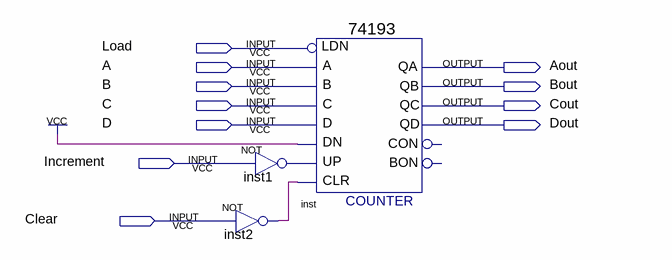
[diagram p0: schematic sheet]
// Quartus schematic 4BitCounter.bdf as structural Verilog: 3 symbols, 11 pins
module \4BitCounter  (
  input  Load,
  input  A,
  input  B,
  input  C,
  input  D,
  input  Increment,
  input  Clear,
  output Aout,
  output Bout,
  output Cout,
  output Dout
);

  wire inst1_out, inst2_out;

  not inst1 (inst1_out, Increment);
  not inst2 (inst2_out, Clear);
  \74193  inst (
    .D(D), .C(C), .B(B), .A(A), .CLR(inst2_out), .UP(inst1_out), .DN(1'b1), .LDN(Load), .QB(Bout), .QA(Aout),
    .QD(Dout), .QC(Cout));  // open: CON, BON
endmodule
